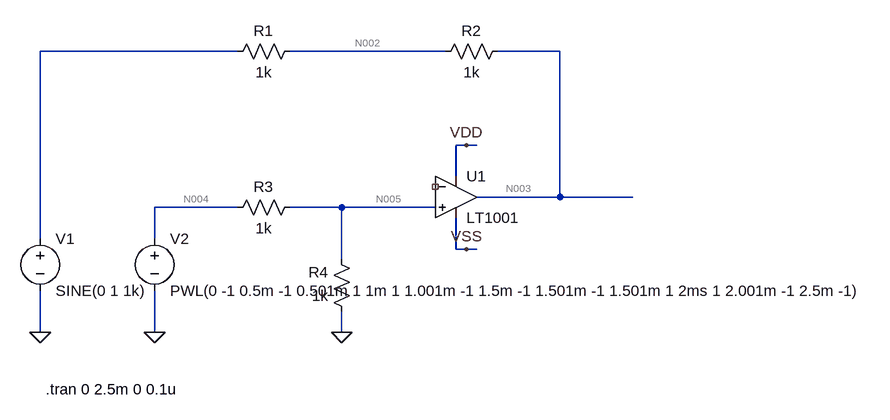
[diagram p0: schematic Draft1.asc]
Draft1.asc, the LTspice schematic file:
Version 4
SHEET 1 980 680
WIRE 16 112 -288 112
WIRE 336 112 96 112
WIRE 512 112 416 112
WIRE 368 256 352 256
WIRE 384 256 368 256
WIRE 352 304 352 256
WIRE 512 336 512 112
WIRE 512 336 384 336
WIRE 624 336 512 336
WIRE 16 352 -112 352
WIRE 176 352 96 352
WIRE 320 352 176 352
WIRE -288 400 -288 112
WIRE -112 400 -112 352
WIRE 352 416 352 368
WIRE 368 416 352 416
WIRE 384 416 368 416
WIRE 176 432 176 352
WIRE -288 544 -288 480
WIRE -112 544 -112 480
WIRE 176 544 176 512
FLAG 176 544 0
FLAG 368 256 VDD
FLAG 368 416 VSS
FLAG -112 544 0
FLAG -288 544 0
SYMBOL res 112 96 R90
WINDOW 0 0 56 VBottom 2
WINDOW 3 32 56 VTop 2
SYMATTR InstName R1
SYMATTR Value 1k
SYMBOL res 432 96 R90
WINDOW 0 0 56 VBottom 2
WINDOW 3 32 56 VTop 2
SYMATTR InstName R2
SYMATTR Value 1k
SYMBOL res 112 336 R90
WINDOW 0 0 56 VBottom 2
WINDOW 3 32 56 VTop 2
SYMATTR InstName R3
SYMATTR Value 1k
SYMBOL res 192 528 R180
WINDOW 0 36 76 Left 2
WINDOW 3 36 40 Left 2
SYMATTR InstName R4
SYMATTR Value 1k
SYMBOL Opamps\\LT1001 352 272 R0
SYMATTR InstName U1
SYMBOL voltage -288 384 R0
WINDOW 123 0 0 Left 2
WINDOW 39 0 0 Left 2
SYMATTR InstName V1
SYMATTR Value SINE(0 1 1k)
SYMBOL voltage -112 384 R0
WINDOW 123 0 0 Left 2
WINDOW 39 0 0 Left 2
SYMATTR InstName V2
SYMATTR Value PWL(0 -1 0.5m -1 0.501m 1 1m 1 1.001m -1 1.5m -1 1.501m -1 1.501m 1 2ms 1 2.001m -1 2.5m -1)
TEXT -280 632 Left 2 !.tran 0 2.5m 0 0.1u

The netlist it stands for:
* Draft1.asc
R1 N002 N001 1k
R2 N003 N002 1k
R3 N005 N004 1k
R4 0 N005 1k
XU1 N005 NC_01 VDD VSS N003 LT1001  ; pins In+ In- V+ V- OUT
V1 N001 0 SINE(0 1 1k)
V2 N004 0 PWL(0 -1 0.5m -1 0.501m 1 1m 1 1.001m -1 1.5m -1 1.501m -1 1.501m 1 2ms 1 2.001m -1 2.5m -1)
.tran 0 2.5m 0 0.1u
.lib LTC.lib
.backanno
.end

* Results of the author's LTspice run, read from the files saved beside the schematic
* Operating Point, zero values left out:
*   V(n002) = 149.9 µV
*   V(n003) = 299.7 µV
*   V(n005) = -500 mV
*   V(n004) = -1 V
*   V(vdd) = 299.7 µV
*   V(vss) = 225.1 mV
*   I(R4) = 500 µA
*   I(R3) = 500 µA
*   I(R2) = 149.9 nA
*   I(R1) = 149.9 nA
*   I(V2) = 500 µA
*   I(V1) = 149.9 nA
*   Ix(u1:1) = -2.188 pA
*   Ix(u1:5) = -149.9 nA
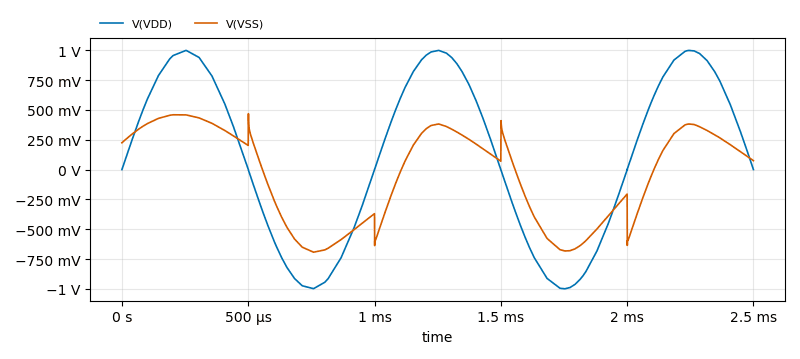
[diagram p1: Transient Analysis of Draft1.asc, plotted from the saved traces]
* Transient Analysis, 1 run:
*   V(VDD): min -999.4 mV, max 999.9 mV, average 127.2 mV, rms 705.9 mV, last 672.1 µV
*   V(VSS): min -692.5 mV, max 469 mV, average -37.18 mV, rms 398 mV, last 75.37 mV